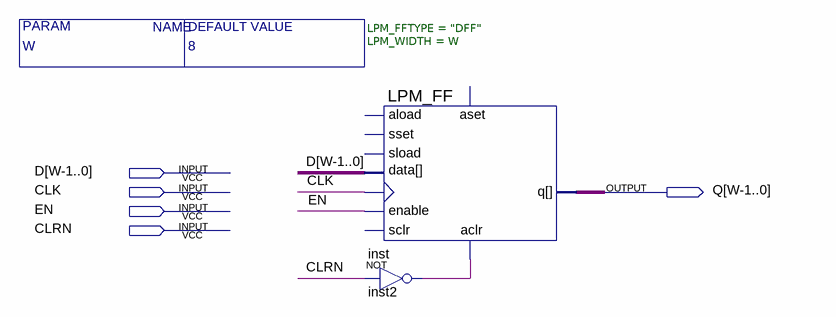
[diagram p0: schematic sheet]
// Quartus schematic regg.bdf as structural Verilog: 2 symbols, 5 pins
module regg #(parameter W = 8) (
  input  [7:0] D,
  input  CLK,
  input  EN,
  input  CLRN,
  output [7:0] Q
);

  wire inst2_out;

  LPM_FF #(.LPM_FFTYPE("DFF"), .LPM_WIDTH(W)) inst (
    .enable(EN), .clock(CLK), .aclr(inst2_out), .data(D), .q(Q));  // open: aload, sset, sload, aset, sclr
  not inst2 (inst2_out, CLRN);
endmodule
